# EAGLE design multiSPI_v21 (EAGLE 9.1.0)
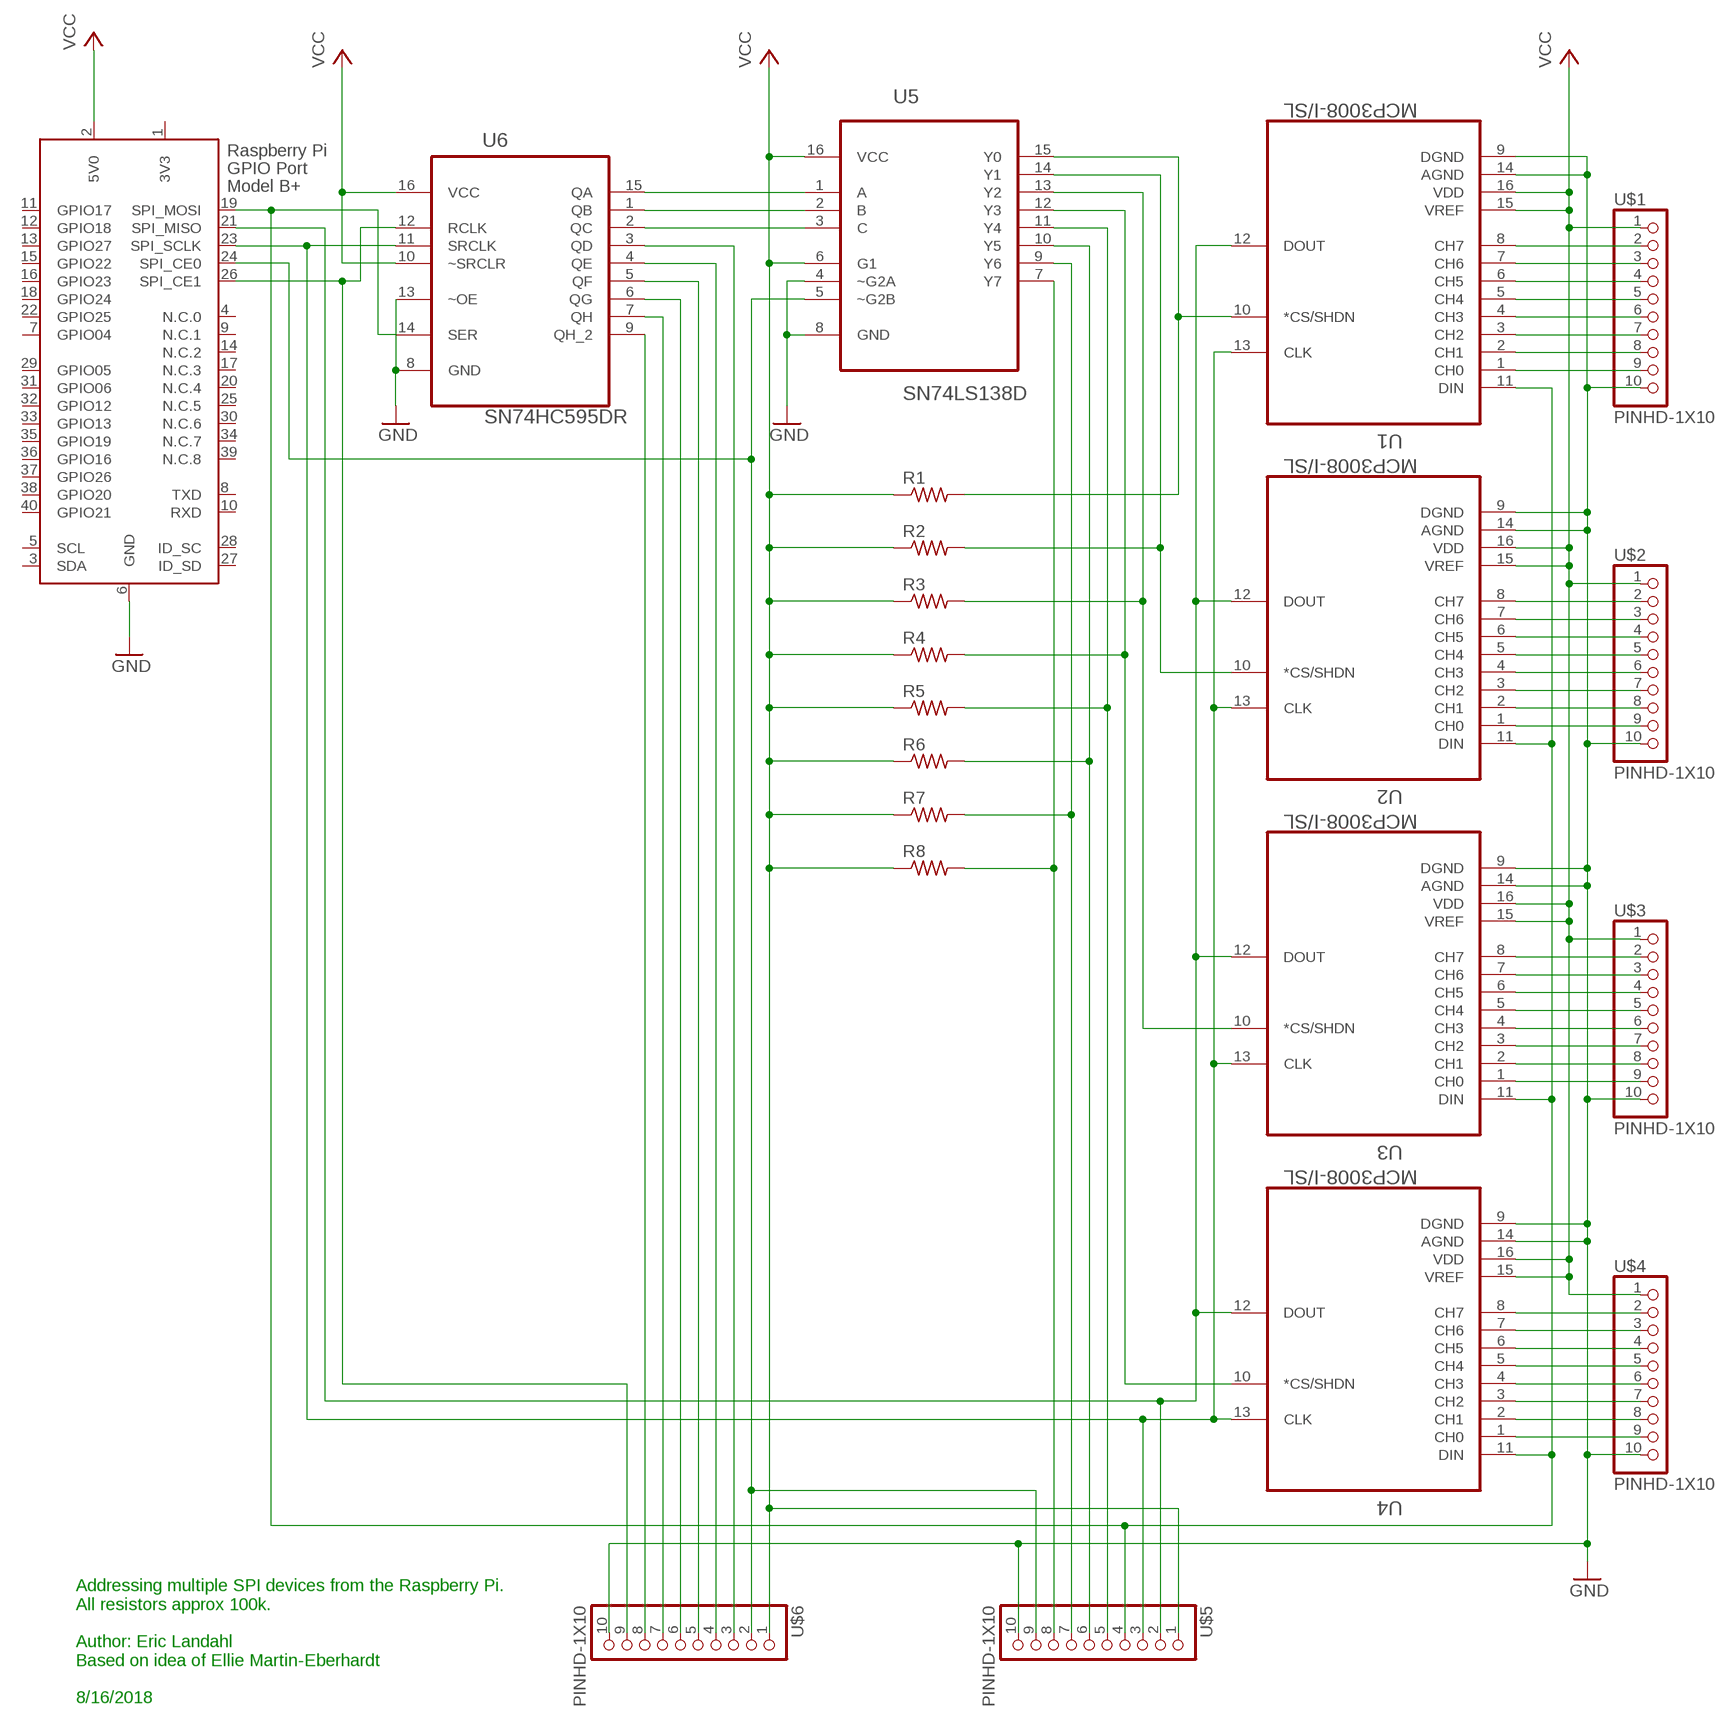
[diagram p0: schematic, sheet 1]

## Parts
R1  R-US_R1210  [R1210]
R2  R-US_R1210  [R1210]
R3  R-US_R1210  [R1210]
R4  R-US_R1210  [R1210]
R5  R-US_R1210  [R1210]
R6  R-US_R1210  [R1210]
R7  R-US_R1210  [R1210]
R8  R-US_R1210  [R1210]
U1  MCP3008-I/SL  [SOIC127P600X175-16N]
U2  MCP3008-I/SL  [SOIC127P600X175-16N]
U3  MCP3008-I/SL  [SOIC127P600X175-16N]
U4  MCP3008-I/SL  [SOIC127P600X175-16N]
U5  SN74LS138D  [SOIC127P600X175-16N]
U6  SN74HC595DR  [SOIC127P600X175-16N]
U$1  PINHD-1X10  [1X10-BIG]
U$2  PINHD-1X10  [1X10-BIG]
U$3  PINHD-1X10  [1X10-BIG]
U$4  PINHD-1X10  [1X10-BIG]
U$5  PINHD-1X10  [1X10-BIG]
U$6  PINHD-1X10  [1X10-BIG]
X1  RASPI_GPIO_B+_BOX  [RASPI_GPIO_B+_BOX]

## Nets
GND: U1.9(DGND) U1.14(AGND) U2.9(DGND) U2.14(AGND) U3.9(DGND) U3.14(AGND) U4.9(DGND) U4.14(AGND) U5.4(~G2A) U5.8(GND) U6.8(GND) U6.13(~OE) U$1.10 U$2.10 U$3.10 U$4.10 U$5.10 U$6.10 X1.6(GND)
N$1: R8.2 U5.7(Y7) U$5.8
N$2: R7.2 U5.9(Y6) U$5.7
N$3: R6.2 U5.10(Y5) U$5.6
N$4: R4.2 U4.10(*CS/SHDN) U5.12(Y3)
N$5: U1.12(DOUT) U2.12(DOUT) U3.12(DOUT) U4.12(DOUT) U$5.2 X1.21(SPI_MISO)
N$6: R3.2 U3.10(*CS/SHDN) U5.13(Y2)
N$7: R5.2 U5.11(Y4) U$5.5
N$8: R2.2 U2.10(*CS/SHDN) U5.14(Y1)
N$9: R1.2 U1.10(*CS/SHDN) U5.15(Y0)
N$10: U1.11(DIN) U2.11(DIN) U3.11(DIN) U4.11(DIN) U6.14(SER) U$5.4 X1.19(SPI_MOSI)
N$11: U6.12(RCLK) U$6.9 X1.26(SPI_CE1)
N$12: U1.8(CH7) U$1.2
N$13: U1.7(CH6) U$1.3
N$14: U1.6(CH5) U$1.4
N$15: U6.9(QH_2) U$6.8
N$16: U1.5(CH4) U$1.5
N$17: U1.4(CH3) U$1.6
N$18: U1.3(CH2) U$1.7
N$19: U1.2(CH1) U$1.8
N$20: U1.1(CH0) U$1.9
N$21: U2.8(CH7) U$2.2
N$22: U2.7(CH6) U$2.3
N$23: U2.6(CH5) U$2.4
N$24: U2.5(CH4) U$2.5
N$25: U2.4(CH3) U$2.6
N$26: U2.3(CH2) U$2.7
N$27: U2.2(CH1) U$2.8
N$28: U2.1(CH0) U$2.9
N$29: U3.1(CH0) U$3.9
N$30: U3.2(CH1) U$3.8
N$31: U3.3(CH2) U$3.7
N$32: U3.4(CH3) U$3.6
N$33: U3.5(CH4) U$3.5
N$34: U3.6(CH5) U$3.4
N$35: U3.7(CH6) U$3.3
N$36: U3.8(CH7) U$3.2
N$37: U4.1(CH0) U$4.9
N$38: U4.2(CH1) U$4.8
N$39: U4.3(CH2) U$4.7
N$40: U4.4(CH3) U$4.6
N$41: U4.5(CH4) U$4.5
N$42: U4.6(CH5) U$4.4
N$43: U4.7(CH6) U$4.3
N$44: U4.8(CH7) U$4.2
N$47: U1.13(CLK) U2.13(CLK) U3.13(CLK) U4.13(CLK) U6.11(SRCLK) U$5.3 X1.23(SPI_SCLK)
N$53: U5.5(~G2B) U$5.9 U$6.2 X1.24(SPI_CE0)
N$54: U6.7(QH) U$6.7
N$55: U6.6(QG) U$6.6
N$56: U6.5(QF) U$6.5
N$57: U6.4(QE) U$6.4
N$58: U6.3(QD) U$6.3
N$59: U5.3(C) U6.2(QC)
N$60: U5.2(B) U6.1(QB)
N$61: U5.1(A) U6.15(QA)
VCC: R1.1 R2.1 R3.1 R4.1 R5.1 R6.1 R7.1 R8.1 U1.15(VREF) U1.16(VDD) U2.15(VREF) U2.16(VDD) U3.15(VREF) U3.16(VDD) U4.15(VREF) U4.16(VDD) U5.6(G1) U5.16(VCC) U6.10(~SRCLR) U6.16(VCC) U$1.1 U$2.1 U$3.1 U$4.1 U$5.1 U$6.1 X1.2(5V0)
Unconnected: X1.3(SDA) X1.4(N.C.0) X1.5(SCL) X1.7(GPIO04) X1.8(TXD) X1.9(N.C.1) X1.10(RXD) X1.11(GPIO17) X1.12(GPIO18) X1.13(GPIO27) X1.14(N.C.2) X1.15(GPIO22) X1.16(GPIO23) X1.17(N.C.3) X1.18(GPIO24) X1.20(N.C.4) X1.22(GPIO25) X1.25(N.C.5) X1.27(ID_SD) X1.28(ID_SC) X1.29(GPIO05) X1.30(N.C.6) X1.31(GPIO06) X1.32(GPIO12) X1.33(GPIO13) X1.34(N.C.7) X1.35(GPIO19) X1.36(GPIO16) X1.37(GPIO26) X1.38(GPIO20) X1.39(N.C.8) X1.40(GPIO21)

## Notes on the sheet
- Addressing multiple SPI devices from the Raspberry Pi.  
  All resistors approx 100k. 
  
  Author: Eric Landahl
  Based on idea of Ellie Martin-Eberhardt
  
  8/16/2018

## Power pins joined to a net without a drawn wire
3V3: X1.1(3V3)

## Library data of the parts
R1-R8 = resistor:R-US_: RESISTOR, American symbol
U1 U4 = Microchip_By_element14_Batch_1:MCP3008-I/SL: 10BIT ADC, 8 CH, SPI, SMD; MPN: MCP3008-I/SL; OC_FARNELL: 1292241; OC_NEWARK: 19C7201; PACKAGE: SOIC16; SUPPLIER: Microchip
U2 U3 = Microchip_By_element14_Batch_1:MCP3008-I/SL: 10BIT ADC, 8 CH, SPI, SMD; MPN: MCP3008-I/SL; OC_FARNELL: 1292241; OC_NEWARK: 19C7201; PACKAGE: SOIC16; SPICEPREFIX: X; SUPPLIER: Microchip
U5 = Texas Instruments_By_element14_Batch_1:SN74LS138D: 3-LINE TO 8-LINE DECODERS /DEMULTIPLEXERXS; MPN: SN74LS138D; OC_FARNELL: 9592288; OC_NEWARK: 67K2854; PACKAGE: SOIC-16; SUPPLIER: TEXAS INSTRUMENTS
U6 = Texas Instruments_By_element14_Batch_1:SN74HC595DR: 8-BIT SHIFT REGISTERS WITH 3-STATE OUTPUT REGISTERS; MPN: SN74HC595DR; OC_FARNELL: 1607849; OC_NEWARK: 67K2850; PACKAGE: SOIC-16; SPICEPREFIX: X; SUPPLIER: TEXAS INSTRUMENTS
U$1-U$6 = adafruit:PINHD-1X10: Pin header 1x10 0.1" spacing With round pins
X1 = raspberrypi_bastelstube_v13:RASPI_GPIO_B+: Only the 2x20 header connector, nothing else

## Board
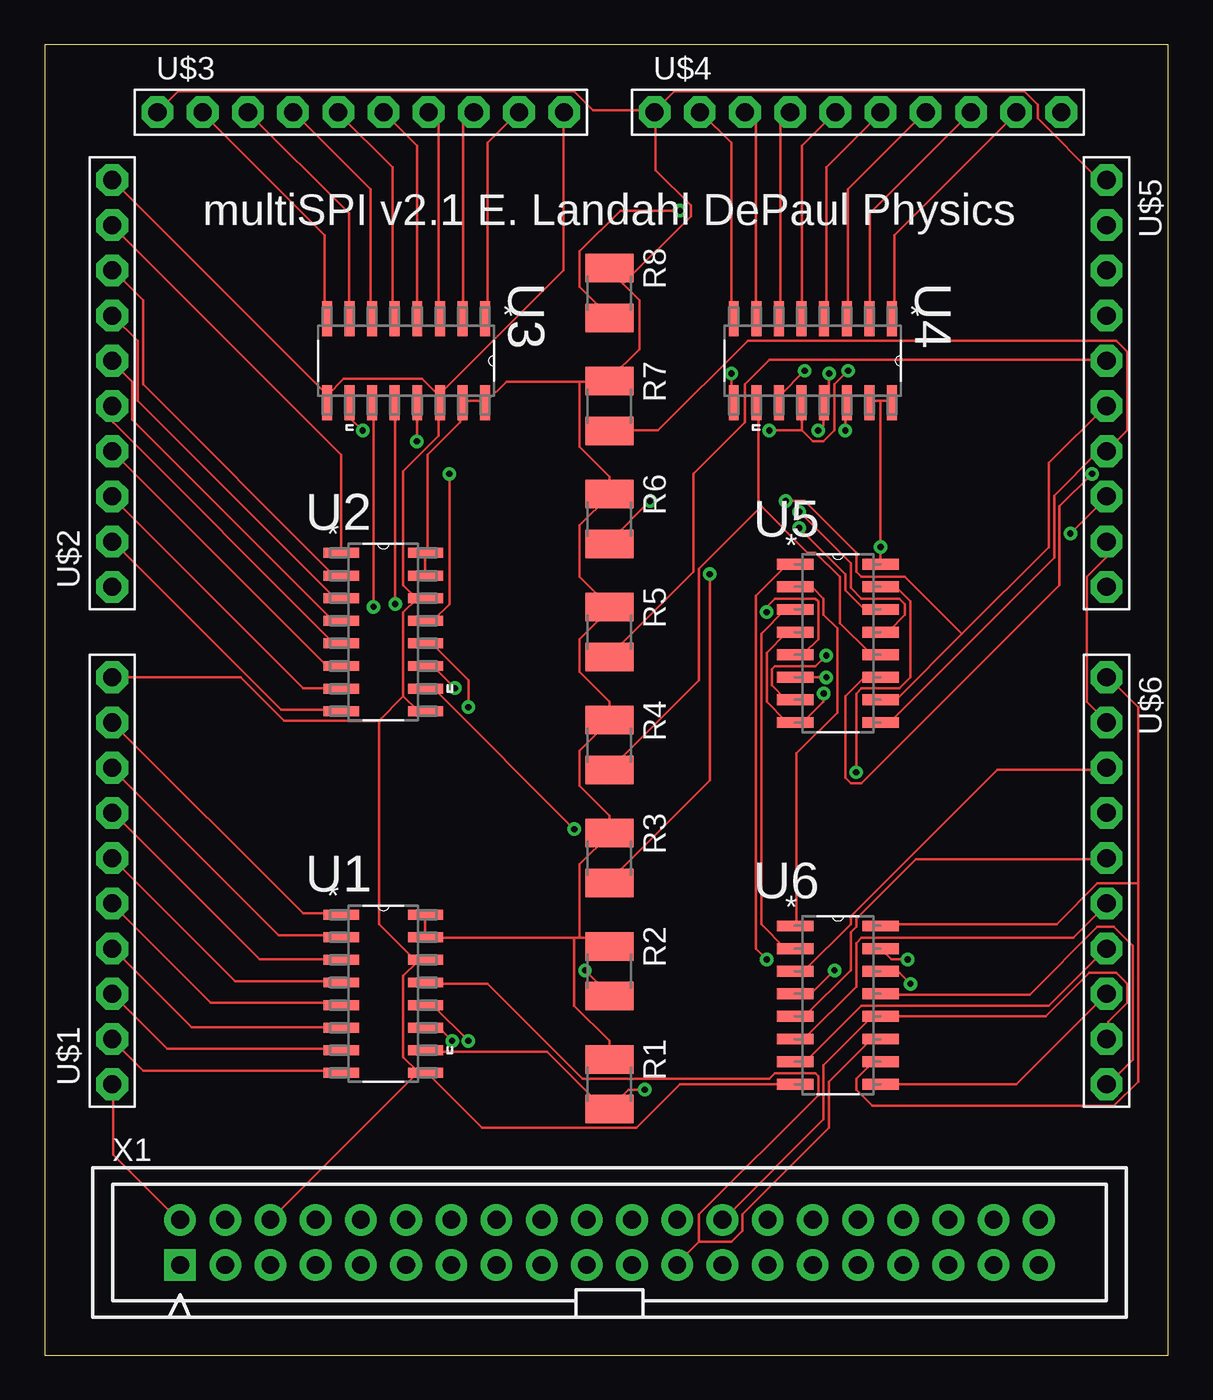
[diagram p1: board, top side]
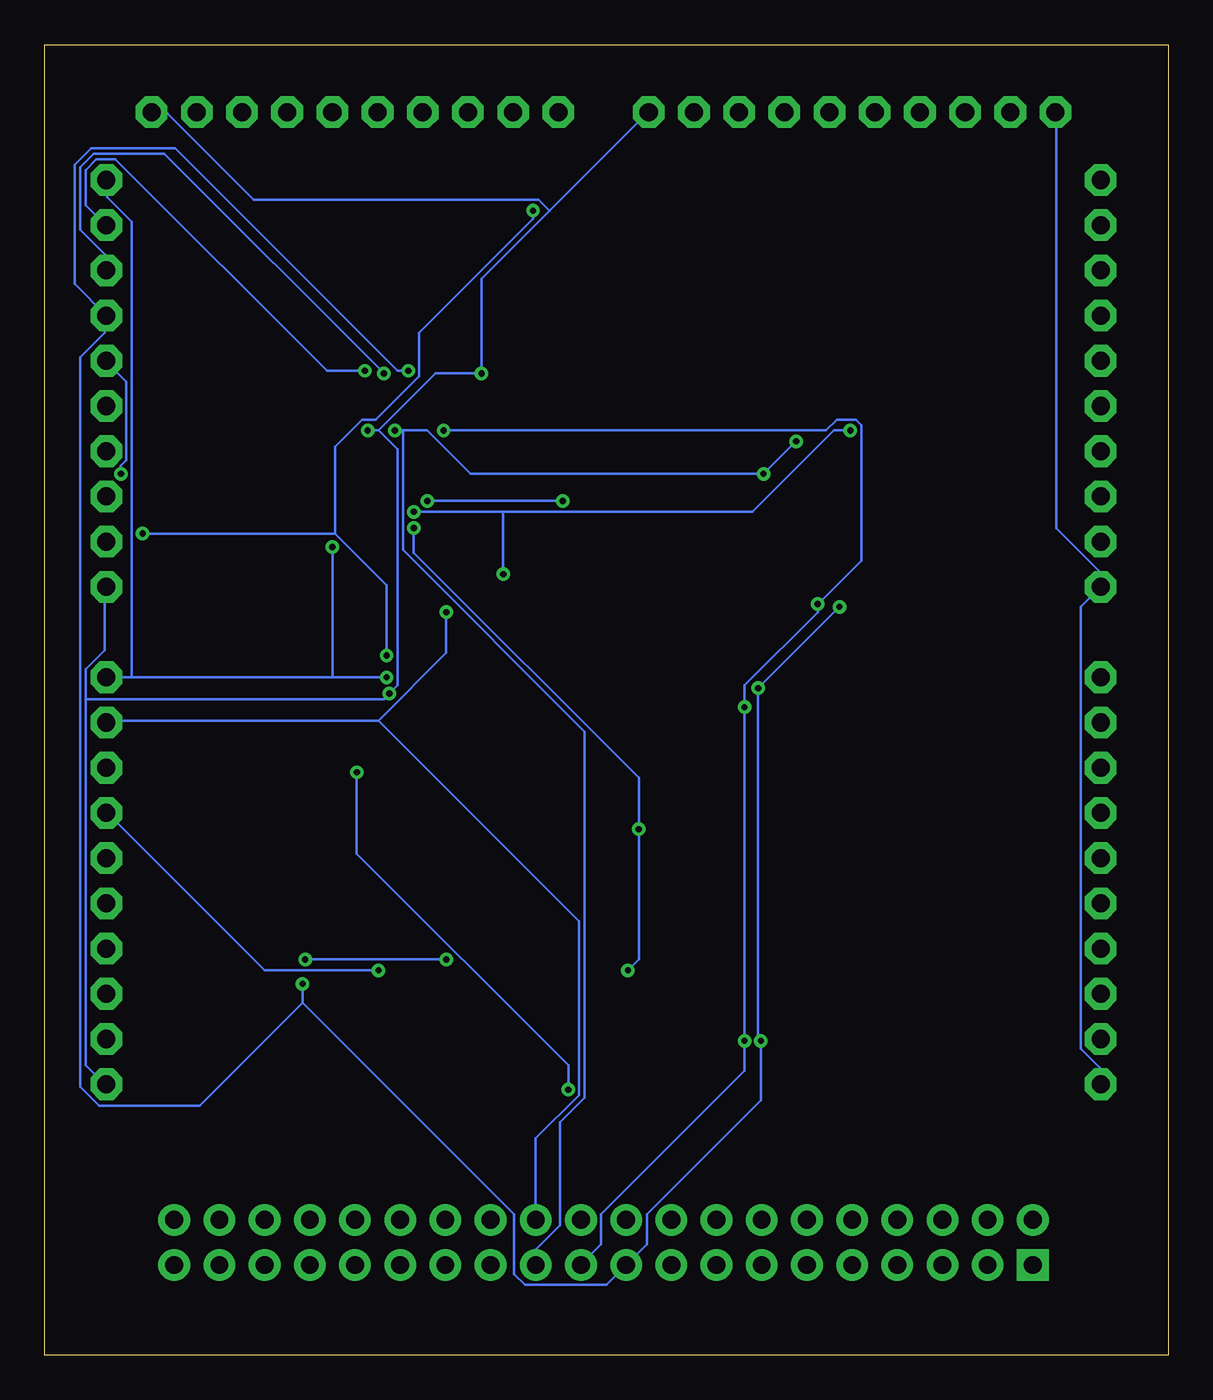
[diagram p2: board, bottom side, seen from below]

Size 63.17 x 73.65 mm. Coordinates in mm from the lower left corner, seen from the top.
Outline: 0,0 63.17,0 63.17,73.65 0,73.65 0,0
Copper layers (1*16): Top 0.035mm / dielectric 1.5mm / Bottom 0.035mm
Design rules "default": minimum track width 6mil, minimum drill 0.35mm, track to track 6mil, track to pad 6mil, pad to pad 6mil, via to via 6mil, smd to smd 6mil, copper to edge 40mil, drill to drill 6mil, minimum pad ring 10mil, minimum via ring 8mil, stop-mask expansion 4mil, vias tented up to drill 0mil, thermal gap 10mil

### Footprints (pad centres in the part's own frame; a part is rotated, then mirrored left to right if it is on the bottom)
R1210 = smd 1.6 x 2.7: 1 -1.4,0; 2 1.4,0
SOIC127P600X175-16N = smd 1.981 x 0.559: 1 -2.362,4.445; 2 -2.362,3.175; 3 -2.362,1.905; 4 -2.362,0.635; 5 -2.362,-0.635; 6 -2.362,-1.905; 7 -2.362,-3.175; 8 -2.362,-4.445; 9 2.362,-4.445; 10 2.362,-3.175; 11 2.362,-1.905; 12 2.362,-0.635; 13 2.362,0.635; 14 2.362,1.905; 15 2.362,3.175; 16 2.362,4.445
SOIC127P600X175-16N' = smd 2.057 x 0.61: 1 -4.801,8.89; 2 -4.801,7.62; 3 -4.801,6.35; 4 -4.801,5.08; 5 -4.801,3.81; 6 -4.801,2.54; 7 -4.801,1.27; 8 -4.801,0; 9 0,0; 10 0,1.27; 11 0,2.54; 12 0,3.81; 13 0,5.08; 14 0,6.35; 15 0,7.62; 16 0,8.89
1X10-BIG = drill 1.016 pad 1.778 octagon: 1 -11.43,0; 2 -8.89,0; 3 -6.35,0; 4 -3.81,0; 5 -1.27,0; 6 1.27,0; 7 3.81,0; 8 6.35,0; 9 8.89,0; 10 11.43,0
RASPI_GPIO_B+_BOX = drill 1 pad 1.778 square: 1 -24.13,-1.27 | drill 1 pad 1.778: 2 -24.13,1.27; 3 -21.59,-1.27; 4 -21.59,1.27; 5 -19.05,-1.27; 6 -19.05,1.27; 7 -16.51,-1.27; 8 -16.51,1.27; 9 -13.97,-1.27; 10 -13.97,1.27; 11 -11.43,-1.27; 12 -11.43,1.27; 13 -8.89,-1.27; 14 -8.89,1.27; 15 -6.35,-1.27; 16 -6.35,1.27; 17 -3.81,-1.27; 18 -3.81,1.27; 19 -1.27,-1.27; 20 -1.27,1.27; 21 1.27,-1.27; 22 1.27,1.27; 23 3.81,-1.27; 24 3.81,1.27; 25 6.35,-1.27; 26 6.35,1.27; 27 8.89,-1.27; 28 8.89,1.27; 29 11.43,-1.27; 30 11.43,1.27; 31 13.97,-1.27; 32 13.97,1.27; 33 16.51,-1.27; 34 16.51,1.27; 35 19.05,-1.27; 36 19.05,1.27; 37 21.59,-1.27; 38 21.59,1.27; 39 24.13,-1.27; 40 24.13,1.27

### Placement (x,y rotation side)
R1  31.75,15.24 270 top
R2  31.75,21.59 270 top
R3  31.75,27.94 270 top
R4  31.75,34.29 270 top
R5  31.75,40.64 270 top
R6  31.75,46.99 270 top
R7  31.75,53.34 270 top
R8  31.75,59.69 270 top
U1  19.05,20.32 0 top
U2  19.05,40.64 0 top
U3  20.32,55.88 270 top
U4  43.18,55.88 270 top
U5  SN74LS138D  [SOIC127P600X175-16N']  46.99,35.56 0 top
U6  SN74HC595DR  [SOIC127P600X175-16N']  46.99,15.24 0 top
U$1  3.81,26.67 90 top
U$2  3.81,54.61 90 top
U$3  17.78,69.85 0 top
U$4  45.72,69.85 0 top
U$5  59.69,54.61 270 top
U$6  59.69,26.67 270 top
X1  31.75,6.35 0 top

### Tracks (layer width: path | path; a pad name or v marks a point on that pad's centre or on a via)
GND  (via drill 0.35)
  Top 0.152: U6.13 46.99,20.27 55.37,20.27 59.18,24.08 60.1,24.08 61.16,23.01 61.16,16.61 59.79,15.24 U$6.10 | U5.4 42.11,40.54 41.66,40.54 40.59,39.47 40.59,36.73 41.66,35.66 42.11,35.66 U5.8 42.27,35.66 42.72,35.66 43.79,36.73 v43.79,37.19 | v38.61,55.17 38.61,53.65 U4.9 | v45.01,51.97 45.01,53.49 U4.14 | 21.08,16 20.93,16 20.17,16.76 20.17,21.34 20.93,22.1 | 21.08,16 21.39,16 U1.9 | 20.93,22.1 21.39,22.1 U1.14 20.93,22.1 | U6.8 35.71,15.24 33.27,12.8 24.59,12.8 21.54,15.85 U1.9 | 21.08,16 X1.6 | 21.08,16 U1.9 | 20.17,37.03 20.93,36.27 21.39,36.27 U2.9 | 20.17,37.03 20.17,41.76 20.93,42.52 | 20.93,42.52 21.39,42.52 U2.14 20.93,42.52 | U$1.10 11.02,38.1 13.46,35.66 18.8,35.66 | 20.17,37.03 18.8,35.66 | 15.9,53.95 15.9,53.65 U3.9 15.9,53.95 | 15.9,53.95 16.82,54.86 21.23,54.86 22.15,53.95 | 22.15,53.95 22.15,53.65 U3.14 | 15.9,53.95 U$2.10 | 20.93,42.52 20.17,43.28 20.17,49.68 22.15,51.66 22.15,53.49 U3.14 | 20.93,22.1 18.8,24.23 18.8,35.66 | 22.15,53.95 29.16,60.96 29.16,69.8 U$3.10 | 22.15,53.95 U3.14
  Bottom 0.152: 60.86,36.88 60.86,16.31 59.79,15.24 U$6.10 | 60.86,36.88 60.86,38.56 59.79,39.62 59.79,43.13 U$5.10 | 34.8,64.31 29.31,69.8 U$3.10 | 34.8,64.31 38.61,60.5 v38.61,55.17 41.2,55.17 44.4,51.97 | 44.4,51.97 v45.01,51.97 | 34.8,64.31 35.41,64.92 51.41,64.92 56.29,69.8 57.05,69.8 U$4.10 | 44.4,51.97 43.33,50.9 43.33,37.64 v43.79,37.19 44.09,36.88 60.86,36.88
N$1  (via drill 0.35)
  Top 0.152: v43.94,39.32 43.33,38.71 41.05,38.71 40.89,38.56 40.89,37.64 41.66,36.88 42.11,36.88 U5.7 | v57.66,46.18 59.64,48.16 U$5.8 | v35.71,64.31 32.36,64.31 30.07,62.03 30.07,60.05 31.75,58.37 R8.2
  Bottom 0.152: v43.94,39.32 43.94,43.28 46.84,46.18 | v57.66,46.18 46.84,46.18 | v35.71,64.31 35.71,63.86 42.11,57.45 42.11,55.02 44.55,52.58 45.31,52.58 46.84,51.05 46.84,46.18
N$2
  Top 0.152: U5.9 46.99,35.66 47.6,35.66 56.74,44.81 56.74,48.31 59.18,50.75 59.64,50.75 U$5.7 60.86,51.97 60.86,56.39 60.25,57 39.52,57 34.49,51.97 31.75,51.97 R7.2
N$3  (via drill 0.35)
  Top 0.152: 51.56,40.54 56.44,45.41 56.44,50.14 59.64,53.34 U$5.6 | 51.56,40.54 47.9,36.88 46.99,36.88 U5.10 | v34.04,48.01 31.75,45.72 R6.2 | v41.66,48.01 42.72,48.01 45.62,45.11 45.62,44.04 45.92,43.74 48.36,43.74 51.56,40.54
  Bottom 0.152: v41.66,48.01 v34.04,48.01
N$4
  Top 0.152: 40.28,47.7 42.88,45.11 43.33,45.11 44.7,43.74 44.7,41.15 46.38,39.47 46.99,39.47 U5.12 | 40.28,47.7 40.13,47.85 40.13,53.49 U4.10 | 40.28,47.7 36.78,44.2 36.78,37.95 31.75,32.92 R4.2
N$5  (via drill 0.35)
  Top 0.152: 42.57,51.97 42.57,53.49 U4.12 | 42.57,51.97 43.18,51.36 43.79,51.36 44.4,51.97 44.4,54.56 v45.16,55.32 | v23.83,17.68 21.84,19.66 21.54,19.66 U1.12 | v23.83,36.42 23.83,37.95 21.84,39.93 21.54,39.93 U2.12 | v19.71,42.22 19.71,53.49 U3.12 | v40.74,51.97 42.57,51.97
  Bottom 0.152: v45.16,55.32 47.3,55.32 59.18,67.21 60.25,67.21 60.86,66.6 60.86,64.62 59.79,63.55 U$5.2 | X1.21 32.97,5.18 31.9,6.25 31.9,7.92 23.83,16 v23.83,17.68 v23.83,36.42 23.83,37.64 19.71,41.76 v19.71,42.22 17.27,44.65 17.27,52.27 17.58,52.58 18.64,52.58 19.25,51.97 v40.74,51.97
N$6  (via drill 0.35)
  Top 0.152: v17.88,51.97 17.27,52.58 17.27,53.49 U3.10 | v42.42,47.4 45.31,44.5 45.31,43.13 45.92,42.52 48.06,42.52 48.36,42.22 48.36,41.6 47.45,40.69 46.99,40.69 U5.13 | v37.39,43.89 37.39,32.31 31.75,26.67 R3.2
  Bottom 0.152: v17.88,51.97 18.8,51.97 23.37,47.4 37.39,47.4 | v42.42,47.4 37.39,47.4 | 37.39,47.4 v37.39,43.89
N$7  (via drill 0.35)
  Top 0.152: U5.11 46.08,38.1 45.01,37.03 45.01,32.46 45.31,32.16 45.92,32.16 57.05,43.28 57.05,47.7 v58.88,49.53 | R5.2 31.75,39.32 36.47,44.04 36.47,49.53 39.37,52.43 39.37,54.56 40.74,55.93 59.64,55.93 U$5.5
  Bottom 0.152: v58.88,49.53 58.88,49.99 58.57,50.29 58.57,54.71 59.64,55.78 U$5.5
N$8  (via drill 0.35)
  Top 0.152: v29.77,29.57 22,37.34 21.54,37.34 U2.10 | v30.38,21.64 31.75,20.27 R2.2 | U5.14 46.08,41.91 45.01,42.98 45.01,43.89 v42.42,46.48
  Bottom 0.152: v30.38,21.64 29.77,22.25 v29.77,29.57 29.77,32.46 42.42,45.11 v42.42,46.48
N$9  (via drill 0.35)
  Top 0.152: 31.75,13.87 31.45,13.87 28.25,17.07 21.54,17.07 U1.10 | v45.62,32.77 45.62,37.19 45.92,37.49 48.06,37.49 48.67,38.1 48.67,42.37 47.9,43.13 46.99,43.13 U5.15 | v33.73,14.94 32.82,14.94 31.75,13.87 | 31.75,13.87 R1.2
  Bottom 0.152: v45.62,32.77 45.62,28.19 33.73,16.31 v33.73,14.94
N$10  (via drill 0.35)
  Top 0.152: v42.72,55.32 41.35,53.95 41.35,53.65 U4.11 | v22.91,17.68 22.3,18.29 21.54,18.29 U1.11 | v23.06,37.49 21.84,38.71 21.54,38.71 U2.11 | v18.49,42.06 18.49,53.49 U3.11 | v48.67,20.88 48.06,21.49 46.99,21.49 U6.14
  Bottom 0.152: v42.72,55.32 43.33,55.32 55.83,67.82 60.55,67.82 61.47,66.9 61.47,60.2 U$5.4 59.79,58.37 59.79,57.45 61.16,56.08 61.16,15.09 60.1,14.02 54.46,14.02 48.67,19.81 | v18.49,42.06 v23.06,37.49 23.06,17.83 v22.91,17.68 22.91,14.33 29.31,7.92 29.31,6.25 X1.19 31.6,3.96 36.17,3.96 36.78,4.57 36.78,7.92 48.67,19.81 | 48.67,19.81 v48.67,20.88
N$11
  Top 0.152: X1.26 38.15,7.62 43.79,13.26 43.79,16.31 46.53,19.05 U6.12 56.29,19.05 58.73,21.49 60.25,21.49 60.86,20.88 60.86,19.81 59.79,18.75 59.79,17.83 U$6.9
N$12
  Top 0.152: U1.8 16.66,16 5.54,16 3.86,17.68 U$1.2
N$13
  Top 0.152: U$1.3 6.91,17.22 16.66,17.22 U1.7
N$14
  Top 0.152: U1.6 16.66,18.44 8.28,18.44 3.86,22.86 U$1.4
N$15
  Top 0.152: U6.9 54.61,15.24 U$6.8
N$16
  Top 0.152: U1.5 16.66,19.81 9.35,19.81 3.86,25.3 U$1.5
N$17
  Top 0.152: U$1.6 10.72,21.03 16.66,21.03 U1.4
N$18
  Top 0.152: U1.3 16.66,22.25 12.09,22.25 3.86,30.48 U$1.7
N$19
  Top 0.152: U1.2 16.66,23.62 13.16,23.62 3.86,32.92 U$1.8
N$20
  Top 0.152: U$1.9 14.53,24.84 16.66,24.84 U1.1
N$21
  Top 0.152: U2.8 16.66,36.27 13.31,36.27 3.86,45.72 U$2.2
N$22
  Top 0.152: U2.7 16.66,37.49 14.53,37.49 3.86,48.16 U$2.3
N$23
  Top 0.152: U$2.4 15.75,38.86 16.66,38.86 U2.6
N$24
  Top 0.152: U2.5 16.66,40.08 16.2,40.08 3.86,52.43 3.86,53.34 U$2.5
N$25
  Top 0.152: U2.4 16.66,41.3 16.2,41.3 4.93,52.58 4.93,54.71 3.86,55.78 U$2.6
N$26
  Top 0.152: U$2.7 5.23,57 5.23,53.65 16.2,42.67 16.66,42.67 U2.3
N$27
  Top 0.152: U2.2 16.66,43.89 16.2,43.89 5.54,54.56 5.54,59.28 3.86,60.96 U$2.8
N$28
  Top 0.152: U2.1 16.66,45.11 16.66,50.6 3.86,63.4 U$2.9
N$29
  Top 0.152: U3.1 24.89,58.37 24.89,68.12 26.57,69.8 U$3.9
N$30
  Top 0.152: U3.2 23.52,58.37 23.52,69.19 24.13,69.8 U$3.8
N$31
  Top 0.152: U3.3 22.15,58.37 22.15,69.34 21.69,69.8 U$3.7
N$32
  Top 0.152: U$3.6 20.93,67.97 20.93,58.37 U3.4
N$33
  Top 0.152: U3.5 19.56,58.37 19.56,66.75 16.51,69.8 U$3.5
N$34
  Top 0.152: U3.6 18.34,58.37 18.34,65.53 14.07,69.8 U$3.4
N$35
  Top 0.152: U$3.3 17.12,64.16 17.12,58.37 U3.7
N$36
  Top 0.152: U3.8 15.75,58.37 15.75,62.94 8.89,69.8 U$3.2
N$37
  Top 0.152: U4.1 47.75,58.37 47.75,62.94 54.61,69.8 U$4.9
N$38
  Top 0.152: U$4.8 46.38,64.16 46.38,58.37 U4.2
N$39
  Top 0.152: U4.3 45.16,58.37 45.16,65.53 49.43,69.8 U$4.7
N$40
  Top 0.152: U4.4 43.94,58.37 43.94,66.75 46.99,69.8 U$4.6
N$41
  Top 0.152: U$4.5 42.57,67.97 42.57,58.37 U4.5
N$42
  Top 0.152: U4.6 41.35,58.37 41.35,69.34 41.81,69.8 U$4.4
N$43
  Top 0.152: U4.7 39.98,58.37 39.98,69.19 39.37,69.8 U$4.3
N$44
  Top 0.152: U4.8 38.61,58.37 38.61,68.12 36.93,69.8 U$4.2
N$47  (via drill 0.35)
  Top 0.152: 36.78,6.4 36.78,7.92 43.48,14.63 43.48,15.7 43.33,15.85 41.05,15.85 40.74,15.54 30.23,15.54 24.89,20.88 21.54,20.88 U1.13 | 36.78,6.4 35.56,5.18 X1.23 | 36.78,6.4 38.61,6.4 39.22,7.01 39.22,7.92 44.09,12.8 44.09,15.39 46.38,17.68 46.99,17.68 U6.11 | v20.93,51.36 20.93,53.49 U3.13 | v22.76,49.53 22.76,42.22 21.84,41.3 21.54,41.3 U2.13 | v43.48,51.97 43.79,52.27 43.79,53.49 U4.13 44.09,53.8 v44.09,55.17
  Bottom 0.152: v20.93,51.36 v22.76,49.53 39.22,49.53 41.66,51.97 43.03,51.97 | 43.03,51.97 v43.48,51.97 | v44.09,55.17 56.44,67.51 60.4,67.51 61.16,66.75 61.16,63.25 59.79,61.87 59.79,60.96 U$5.3 | X1.23 35.56,5.94 34.19,7.32 34.19,13.11 32.82,14.48 32.82,35.05 43.03,45.26 43.03,51.97
N$53  (via drill 0.35)
  Top 0.152: v40.59,41.76 40.59,42.06 41.05,42.52 43.33,42.52 43.48,42.37 43.48,40.23 42.72,39.47 42.27,39.47 U5.5 | U$5.9 59.64,45.72 59.64,44.81 58.57,43.74 58.57,36.73 59.64,35.66 U$6.2
  Bottom 0.152: v40.59,41.76 40.59,39.47 44.4,35.66 | 44.4,35.66 59.64,35.66 U$6.2 | X1.24 35.56,12.19 33.12,14.63 33.12,24.38 44.4,35.66
N$54
  Top 0.152: U6.7 42.27,16.61 42.88,16.61 45.92,19.66 56.44,19.66 59.64,22.86 U$6.7
N$55
  Top 0.152: U6.6 42.27,17.83 42.72,17.83 45.62,20.73 45.62,23.16 45.92,23.47 57.81,23.47 59.64,25.3 U$6.6
N$56
  Top 0.152: U6.5 42.72,19.05 45.31,21.64 45.31,23.77 45.62,24.08 45.62,24.54 48.97,27.89 59.64,27.89 U$6.5
N$57  (via drill 0.35)
  Top 0.152: v44.4,21.64 43.18,20.42 42.27,20.42 U6.4
  Bottom 0.152: v44.4,21.64 50.8,21.64 59.64,30.48 U$6.4
N$58
  Top 0.152: U6.3 42.27,21.64 42.72,21.64 45.31,24.23 45.31,24.69 53.54,32.92 59.64,32.92 U$6.3
N$59
  Top 0.152: U6.2 41.66,22.86 40.28,24.23 40.28,40.54 41.66,41.91 U5.3
N$60
  Top 0.152: U6.1 42.27,24.23 42.27,33.83 44.55,36.12 44.55,40.84 43.79,41.6 43.79,42.52 43.18,43.13 42.27,43.13 U5.2
N$61  (via drill 0.35)
  Top 0.152: v40.59,22.25 39.98,22.86 39.98,42.67 41.66,44.35 42.11,44.35 U5.1 | v48.51,22.25 47.6,22.25 U6.15
  Bottom 0.152: v48.51,22.25 v40.59,22.25
VCC  (via drill 0.35)
  Top 0.152: 46.99,53.65 47.6,53.65 U4.16 | 46.99,53.65 46.38,53.65 U4.15 | 46.99,53.65 v46.99,45.41 U5.16 | 61.47,26.52 61.47,36.42 59.79,38.1 U$6.1 | 61.47,26.52 61.47,15.39 60.1,14.02 46.53,14.02 45.62,14.94 45.62,15.54 46.53,16.46 46.99,16.46 U6.10 | 61.47,26.52 59.18,26.52 56.9,24.23 46.99,24.23 U6.16 | v43.94,38.1 U5.6 | U1.16 21.39,24.69 21.39,23.62 U1.15 21.54,23.47 29.77,23.47 | 30.07,23.47 31.29,23.47 31.75,23.01 R2.1 | 30.07,23.47 29.77,23.47 | R1.1 31.75,17.68 29.77,19.66 29.77,23.47 | 30.07,23.47 30.07,27.58 31.75,29.26 R3.1 31.75,30.33 30.07,32 30.07,33.98 31.75,35.66 R4.1 31.75,36.73 30.07,38.41 30.07,40.23 31.75,41.91 R5.1 31.75,42.06 30.07,43.74 30.07,46.63 31.75,48.31 R6.1 31.75,49.38 30.07,51.05 30.07,54.71 | U2.15 21.39,43.89 21.39,44.96 U2.16 21.54,45.11 21.54,50.6 23.37,52.43 23.37,53.49 U3.15 23.52,53.65 24.74,53.65 U3.16 25.96,54.71 30.07,54.71 | 30.07,54.71 31.75,54.71 R7.1 31.75,54.86 33.43,56.54 33.43,59.28 32.51,60.2 | 32.51,60.2 31.75,60.96 R8.1 | 32.51,60.2 36.32,64.01 36.32,64.62 34.34,66.6 34.34,69.8 U$4.1 | U$1.1 3.86,15.24 3.86,11.28 7.52,7.62 X1.2 | U$3.1 7.52,71.02 29.77,71.02 30.84,69.95 34.19,69.95 U$4.1 | U$5.1 59.64,66.14 59.18,66.14 55.83,69.49 55.83,70.26 55.07,71.02 35.41,71.02 34.34,69.95 U$4.1
  Bottom 0.152: U$6.1 58.27,38.1 | 58.27,38.1 46.99,38.1 | 46.99,38.1 v43.94,38.1 | 58.27,38.1 58.27,63.7 59.64,65.08 59.64,65.99 U$5.1 | 46.99,38.1 v46.99,45.41 | U$3.1 6.3,69.8 6.3,46.48 3.86,44.04 3.86,43.28 U$2.1 4.93,42.06 4.93,17.22 3.86,16.15 3.86,15.24 U$1.1

### Text on the board
tPlace: multiSPI v2.1 E. Landahl DePaul Physics